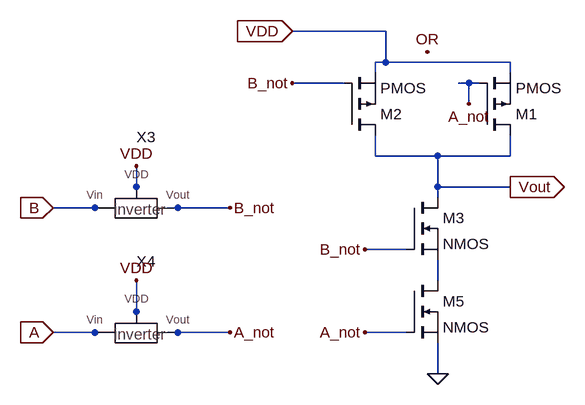
[diagram p0: schematic OR_gate.asc]
OR_gate.asc, the LTspice schematic file:
Version 4
SHEET 1 880 680
WIRE 208 -288 64 -288
WIRE 208 -240 208 -288
WIRE 208 -240 192 -240
WIRE 400 -240 208 -240
WIRE 192 -224 192 -240
WIRE 400 -224 400 -240
WIRE 144 -208 64 -208
WIRE 336 -208 320 -208
WIRE 352 -208 336 -208
WIRE 336 -176 336 -208
WIRE 192 -96 192 -128
WIRE 288 -96 192 -96
WIRE 400 -96 400 -128
WIRE 400 -96 288 -96
WIRE -176 -48 -176 -80
WIRE 288 -48 288 -96
WIRE 400 -48 288 -48
WIRE -176 -32 -176 -48
WIRE 288 -32 288 -48
WIRE -240 -16 -304 -16
WIRE -224 -16 -240 -16
WIRE -112 -16 -128 -16
WIRE -32 -16 -112 -16
WIRE 240 48 176 48
WIRE 288 96 288 64
WIRE -176 144 -176 96
WIRE -176 160 -176 144
WIRE -240 176 -304 176
WIRE -224 176 -240 176
WIRE -112 176 -128 176
WIRE -32 176 -112 176
WIRE 240 176 176 176
WIRE 288 240 288 192
FLAG 288 240 0
FLAG 272 -256 OR
FLAG 176 176 A_not
FLAG 336 -176 A_not
FLAG 64 -208 B_not
FLAG 176 48 B_not
FLAG 400 -48 Vout
IOPIN 400 -48 Out
FLAG -304 -16 B
IOPIN -304 -16 In
FLAG -32 -16 B_not
FLAG -304 176 A
IOPIN -304 176 In
FLAG -32 176 A_not
FLAG 64 -288 VDD
IOPIN 64 -288 In
FLAG -176 96 VDD
FLAG -176 -80 VDD
SYMBOL nmos 240 96 R0
SYMATTR InstName M5
SYMBOL pmos 352 -128 M180
SYMATTR InstName M1
SYMBOL pmos 144 -128 M180
SYMATTR InstName M2
SYMBOL nmos 240 -32 R0
SYMATTR InstName M3
SYMBOL Inverter -144 0 R0
SYMATTR InstName X3
SYMBOL Inverter -144 192 R0
SYMATTR InstName X4

The netlist it stands for:
* OR_gate.asc
M5 N001 A_not 0 0 NMOS
M1 Vout A_not VDD VDD PMOS
M2 Vout B_not VDD VDD PMOS
M3 Vout B_not N001 N001 NMOS
XX3 B VDD B_not Inverter  ; pins Vin VDD Vout
XX4 A VDD A_not Inverter  ; pins Vin VDD Vout
.model NMOS NMOS
.model PMOS PMOS
.lib standard.mos
.backanno
.end